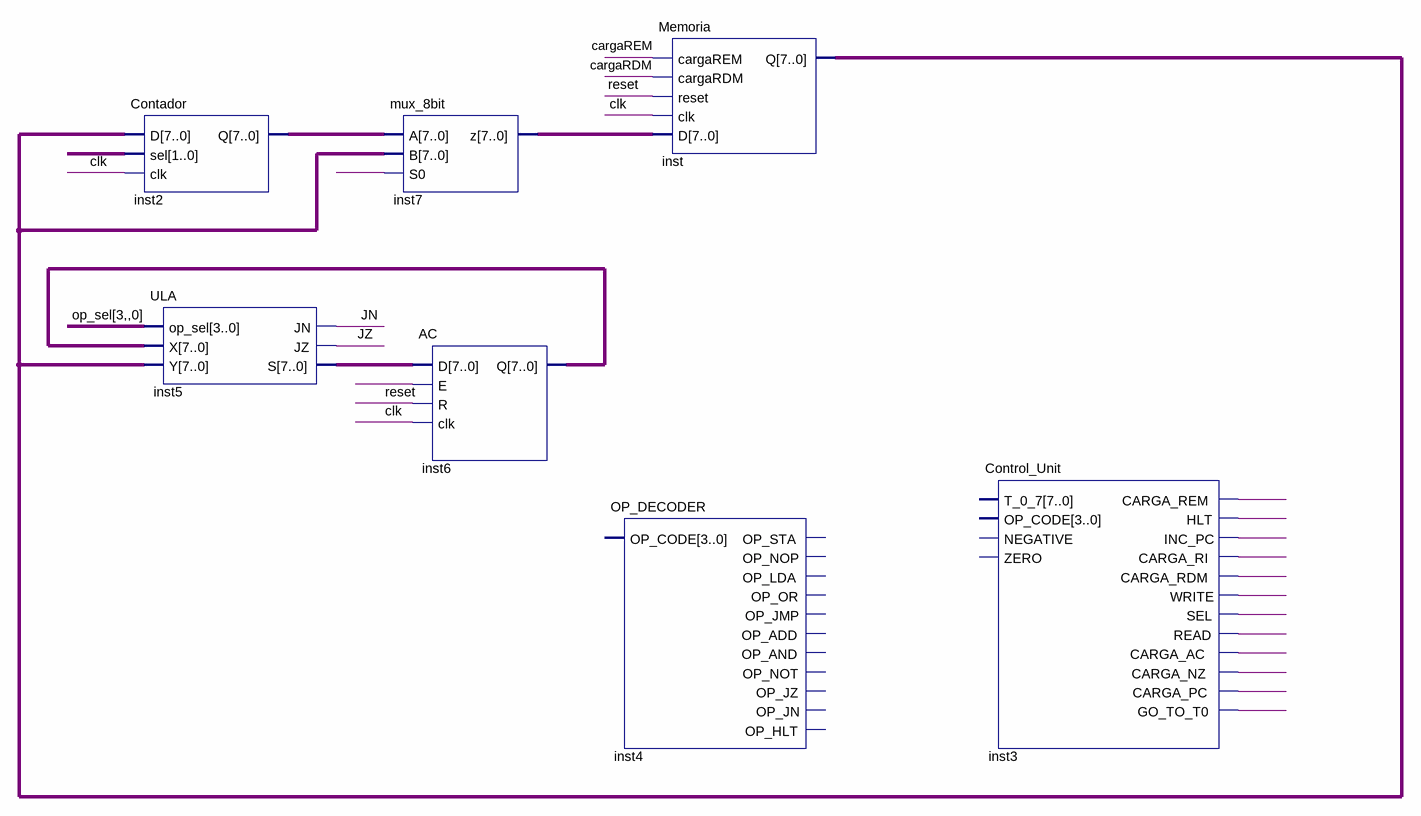
[diagram p0: schematic sheet]
// Quartus schematic rascunho.bdf as structural Verilog: 7 symbols, 0 pins
module rascunho (
);

  wire cargaRDM, cargaREM, clk, inst3_carga_ac, inst3_carga_nz, inst3_carga_pc, inst3_carga_rdm,
       inst3_carga_rem, inst3_carga_ri, inst3_go_to_t0, inst3_hlt, inst3_inc_pc, inst3_read, inst3_sel,
       inst3_write, JN, JZ, reset, undriven_2, undriven_3;
  wire [1:0] undriven_4;
  wire [3:0] undriven;
  wire [7:0] inst2_q, inst5_s, inst6_q, inst7_z, inst_q;

  Contador inst2 (.D(inst_q), .sel(undriven_4), .clk(clk), .Q(inst2_q));
  ULA inst5 (.op_sel(undriven), .X(inst6_q), .Y(inst_q), .JN(JN), .JZ(JZ), .S(inst5_s));
  mux_8bit inst7 (.A(inst2_q), .B(inst_q), .S0(undriven_3), .z(inst7_z));
  AC inst6 (.D(inst5_s), .E(undriven_2), .R(reset), .clk(clk), .Q(inst6_q));
  OP_DECODER inst4 ();  // open: OP_CODE, OP_STA, OP_NOP, OP_LDA, OP_OR, OP_JMP, OP_ADD, OP_AND, OP_NOT, OP_JZ, OP_JN, OP_HLT
  Memoria inst (.cargaREM(cargaREM), .cargaRDM(cargaRDM), .reset(reset), .clk(clk), .D(inst7_z), .Q(inst_q));
  Control_Unit inst3 (
    .CARGA_REM(inst3_carga_rem), .HLT(inst3_hlt), .INC_PC(inst3_inc_pc), .CARGA_RI(inst3_carga_ri),
    .CARGA_RDM(inst3_carga_rdm), .WRITE(inst3_write), .SEL(inst3_sel), .READ(inst3_read),
    .CARGA_AC(inst3_carga_ac), .CARGA_NZ(inst3_carga_nz), .CARGA_PC(inst3_carga_pc), .GO_TO_T0(inst3_go_to_t0));  // open: T_0_7, OP_CODE, NEGATIVE, ZERO
endmodule
